# Altium schematic sheet MainBoard.SchDoc
size A; SheetNumber: 1; SheetTotal: 1
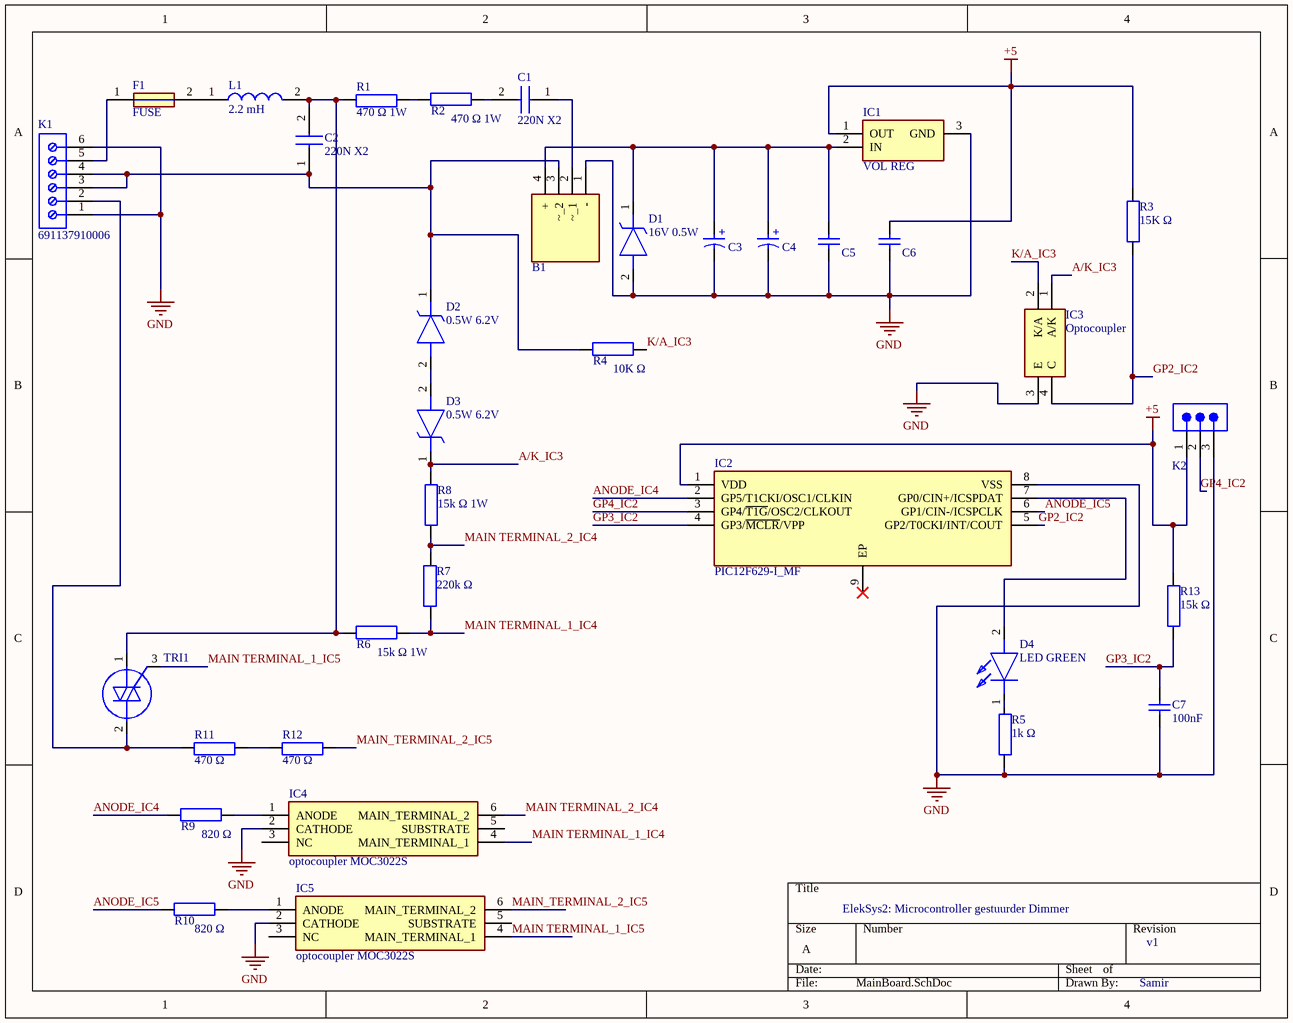
[diagram p0: MainBoard.SchDoc]

## Parts
B1  (no value)  [TO508P370X2000X1310-4P]
C1  220N X2  [B32932A_(18_x_8.5)]
C2  220N X2  [B32932A_(18_x_8.5)]
C3  220uF  [WCAP-ATG8_D8H11.5]  (value not drawn)
C4  220uF  [WCAP-ATG8_D8H11.5]  (value not drawn)
C5  100nF  [WCAP-CSGP_0805_L2W1.25H0.8_Reflow]  (value not drawn)
C6  100nF  [WCAP-CSGP_0805_L2W1.25H0.8_Reflow]  (value not drawn)
C7  100nF  [WCAP-CSGP_0805_L2W1.25H0.8_Reflow]
D1  16V 0.5W  [DIOM5226X220N]
D2  0.5W 6.2V  [Zener Diodes ZEN REG 0.5W 6.2V]
D3  0.5W 6.2V  [Zener Diodes ZEN REG 0.5W 6.2V]
D4  LED GREEN  [LED 0805]
F1  FUSE  [FUSE MRT]
IC1  VOL REG  [Vol reg]
IC2  PIC12F629-I_MF  [PIC12F629-I_MF]
IC3  Optocoupler  [optocoupler smd]
IC4  optocoupler MOC3022S  [optoucoupler MOC3022S]
IC5  optocoupler MOC3022S  [optoucoupler MOC3022S]
K1  691137910006  [691137910006]
K2  61300311121  [connector 3p M]  (value not drawn)
L1  2.2 mH  [2.2mH inductor]
R1  470 Ω 1W  [RES_THT_1W]
R2  470 Ω 1W  [RES_THT_1W]
R3  15K Ω  [Res 0805]
R4  10K Ω  [Res 0805]
R5  1k Ω  [Res 0805]
R6  15k Ω 1W  [RES_THT_1W]
R7  220k Ω  [Res 0805]
R8  15k Ω 1W  [RES_THT_1W]
R9  820 Ω  [Res 0805]
R10  820 Ω  [Res 0805]
R11  470 Ω  [Res 0805]
R12  470 Ω  [Res 0805]
R13  15k Ω  [Res 0805]
TRI1  BT137S-600,118  [triac bt137]  (value not drawn)

## Nets
+5: C6.2 IC1.1(OUT) IC2.1(VDD) K2.1 R3.1 R13.1
GND: B1.1(-) C3.2(N) C4.2(N) C5.1 C6.1 C7.2 D1.2(A) IC1.3(GND) IC2.8(VSS) IC3.3(E) IC4.2(CATHODE) IC5.2(CATHODE) K1.1 K1.6 K2.3 R5.2
A/K_IC3: D3.1(K) IC3.1(A/K) R8.1
ANODE_IC4: IC2.2(GP5/T1CKI/OSC1/CLKIN) R9.1
ANODE_IC5: IC2.6(GP1/CIN-/ICSPCLK) R10.1
GP2_IC2: IC2.5(GP2/T0CKI/INT/COUT) IC3.4(C) R3.2
GP3_IC2: C7.1 IC2.4(GP3/~{MCLR}/VPP) R13.2
GP4_IC2: IC2.3(GP4/~{T1G}/OSC2/CLKOUT) K2.2
K/A_IC3: IC3.2(K/A) R4.2
MAIN TERMINAL_1_IC4: IC4.4(MAIN_TERMINAL_1) R6.2 R7.1
MAIN TERMINAL_1_IC5: IC5.4(MAIN_TERMINAL_1) TRI1.3(G)
MAIN TERMINAL_2_IC4: IC4.6(MAIN_TERMINAL_2) R7.2 R8.2
MAIN_TERMINAL_2_IC5: IC5.6(MAIN_TERMINAL_2) R12.1
NetB1_2: B1.2(~_1) C1.1
NetB1_3: B1.3(~_2) C2.1 D2.1(K) K1.3 K1.4 R4.1
NetB1_4: B1.4(+) C3.1(P) C4.1(P) C5.2 D1.1(K) IC1.2(IN)
NetC1_2: C1.2 R2.2
NetC2_2: C2.2 L1.2 R1.2 R6.1 TRI1.1(MT1)
NetD2_2: D2.2(A) D3.2(A)
NetD4_1: D4.1(K) R5.1
NetD4_2: D4.2(A) IC2.7(GP0/CIN+/ICSPDAT)
NetF1_1: F1.1 K1.5
NetF1_2: F1.2 L1.1
NetIC4_1: IC4.1(ANODE) R9.2
NetIC5_1: IC5.1(ANODE) R10.2
NetK1_2: K1.2 R11.2 TRI1.2(MT2)
NetR1_1: R1.1 R2.1
NetR11_1: R11.1 R12.2

Not connected (* = marked no-connect by the designer): IC2 9(EP)*; IC4 3(NC) 5(SUBSTRATE); IC5 3(NC) 5(SUBSTRATE)

## Notes on the sheet
- ElekSys2: Microcontroller gestuurder Dimmer
- v1
- Samir
- (in symbol Elco D8-H11.5) +

## Library data of the parts
B1 = GBUA10M-BP: Bridge Rectifier GBUA10M-BP; Manufacturer_Name: MCC; Datasheet Link: https://www.mccsemi.com/pdf/Products/GBUA10M(JC).pdf; Height: 3.7mm; Manufacturer_Part_Number: GBUA10M-BP
C1 C2 = 220N X2 safetycap: Capacitor B32932A3224K189; Manufacturer_Name: TDK; Datasheet Link: https://product.tdk.com/system/files/dam/doc/product/capacitor/film/emi/data_sheet/20/20/ds/mkt_b32932_936.pdf; Manufacturer_Part_Number: B32932A3224K189; Mouser Part Number: 871-B32932A3224K189; Mouser Price/Stock: https://www.mouser.co.uk/ProductDetail/EPCOS-TDK/B32932A3224K189?qs=xUjyHVpcJwaD87vZwqy58g%3D%3D
C3 C4 = Elco D8-H11.5: WCAP-ATG8 Aluminum Electrolytic Capacitor, Radial, THT, D8 x H11.5mm, 220uF, 35V; Manufacturer Part Number: 860010574011; Manufacturer: Wurth Elektronik; Capacitance Tolerance: +/-20%; Dissipation Factor: 12%; Endurance: 2000h; Leakage Current: 77uA; Ripple Current: 385mA; Technical Reference: ATBE115221M035DSPA7B000; Category: Aluminum Electrolytic Capacitors; Match Code: WCAP-ATG8; ComponentLink1Description: Website Link; ComponentLink1URL: https://www.we-online.com/redexpert/article/860010574011?ad; ComponentLink2Description: Datasheet Link; ComponentLink2URL: https://www.we-online.com/redexpert/spec/860010574011?ad; Mount: Through Hole; Operating Temperature Max: 85°C; Operating Temperature Min: -40°C; Packaging: Ammo Pack; Height: 11.5mm; Diameter: 8mm; Capacitance: 220uF; Rated Voltage (DC): 35V
C5-C7 = CeramicCap 0805: WCAP-CSGP Multilayer Ceramic Chip Capacitor, General Purpose, size 0805, X7R, 100nF, 50VDC; Manufacturer Part Number: 885012207098; Manufacturer: Wurth Elektronik; Case/Size Code: 0805; Capacitance Tolerance: +/-10%; Dissipation Factor: 2.5%; Insulation Resistance: 5GOhm; Rated Voltage (DC): 50V; Technical Reference: X7R0805104K050DFCT10000; Category: Multilayer Ceramic Chip Capacitors; Match Code: WCAP-CSGP; ComponentLink1Description: Website Link; ComponentLink1URL: https://www.we-online.com/redexpert/article/885012207098?ad; ComponentLink2Description: Datasheet Link; ComponentLink2URL: https://www.we-online.com/redexpert/spec/885012207098?ad; Mount: Surface Mount; Operating Temperature Max: 125°C; Operating Temperature Min: -55°C; Packaging: Tape and Reel; Length: 2mm; Width: 1.25mm; Height: 0.8mm; Capacitance: 100nF; Ceramic Type: X7R
D1 = Zener 16V 0.5W: Zener Diode / SZ1SMA5930BT3G; Manufacturer_Name: onsemi; Datasheet Link: https://www.onsemi.com/pub/Collateral/1SMA5913BT3-D.PDF; Height: 2.2mm; Manufacturer_Part_Number: SZ1SMA5930BT3G; Mouser Part Number: 863-SZ1SMA5930BT3G; Mouser Price/Stock: https://www.mouser.co.uk/ProductDetail/onsemi/SZ1SMA5930BT3G?qs=PJJcWtbOkNU2Dey35wiGFw%3D%3D; Arrow Part Number: SZ1SMA5930BT3G; Arrow Price/Stock: https://www.arrow.com/en/products/sz1sma5930bt3g/on-semiconductor
D2 D3 = Zener Diodes ZEN REG 0.5W 6.2V: Zener Diode / SZMMSZ4691T1G; Manufacturer_Name: onsemi; Datasheet Link: https://componentsearchengine.com/Datasheets/2/SZMMSZ4691T1G.pdf; Height: 1.35mm; Manufacturer_Part_Number: SZMMSZ4691T1G; Mouser Part Number: 863-SZMMSZ4691T1G; Mouser Price/Stock: https://www.mouser.co.uk/ProductDetail/onsemi/SZMMSZ4691T1G?qs=PJJcWtbOkNVmtHltI2Mc2w%3D%3D; Arrow Part Number: SZMMSZ4691T1G; Arrow Price/Stock: https://www.arrow.com/en/products/szmmsz4691t1g/on-semiconductor?region=nac
D4 = LED GREEN: LED HSMG-C170; Manufacturer_Name: Avago Technologies; Datasheet Link: https://datasheet.datasheetarchive.com/originals/distributors/SFDatasheet-4/sf-00083853.pdf; Height: 0.8mm; Manufacturer_Part_Number: HSMG-C170; Mouser Part Number: 630-HSMG-C170; Mouser Price/Stock: https://www.mouser.co.uk/ProductDetail/Broadcom-Avago/HSMG-C170?qs=YDL0qNrpDT4lm8ArMPkMEA%3D%3D
F1 = FUSE MRT_1.6_AMMO: Manufacturer_Name: BelFuse; Manufacturer_Part_Number: MRT 1.6 AMMO; Datasheet Link: https://www.belfuse.com/resources/datasheets/circuitprotection/ds-cp-mrt-series.pdf; Height: 7.9mm; Mouser Part Number: 530-MRT1.6AMMO; Mouser Price/Stock: https://www.mouser.co.uk/ProductDetail/Bel-Fuse/MRT-16-AMMO?qs=MvPYbBWWJyvzAphvU3%252BjhQ%3D%3D; Arrow Part Number: MRT 1.6 AMMO; Arrow Price/Stock: https://www.arrow.com/en/products/mrt1.6-ammo/bel-group
IC1 = VOL REG: Integrated Circuit LM3480IM3X-5.0_NOPB; Manufacturer_Name: Texas Instruments; Manufacturer_Part_Number: LM3480IM3X-5.0/NOPB; Datasheet Link: http://www.ti.com/lit/gpn/LM3480; Height: 1.12mm; Mouser Part Number: 926-LM3480IM3X50NOPB; Mouser Price/Stock: https://www.mouser.co.uk/ProductDetail/Texas-Instruments/LM3480IM3X-5.0-NOPB?qs=X1J7HmVL2ZHSOja%2Fw1xDFA%3D%3D; Arrow Part Number: LM3480IM3X-5.0/NOPB; Arrow Price/Stock: https://www.arrow.com/en/products/lm3480im3x-5.0nopb/texas-instruments?region=nac
IC2 = PIC12F629-I_MF: Integrated Circuit; Manufacturer_Name: Microchip; Manufacturer_Part_Number: PIC12F629-I/MF; Datasheet Link: http://ww1.microchip.com/downloads/en/DeviceDoc/41190G.pdf; Height: 1mm; Mouser Part Number: 579-PIC12F629-I/MF; Mouser Price/Stock: https://www.mouser.co.uk/ProductDetail/Microchip-Technology-Atmel/PIC12F629-I-MF?qs=Ux5rHyN1IXRyFoXTct%252B9Fg%3D%3D; Arrow Part Number: PIC12F629-I/MF; Arrow Price/Stock: https://www.arrow.com/en/products/pic12f629-imf/microchip-technology
IC3 = optocoupler smd: Inductor SFH6206-3T; Manufacturer_Name: Vishay; Datasheet Link: https://www.vishay.com/docs/83675/sfh620a.pdf; Height: 4.1mm; Manufacturer_Part_Number: SFH6206-3T; Mouser Part Number: 782-SFH6206-3T; Mouser Price/Stock: https://www.mouser.co.uk/ProductDetail/Vishay-Semiconductors/SFH6206-3T?qs=%2Fjqivxn91cfcfJy%252Bpwis%2Fw%3D%3D; Arrow Part Number: SFH6206-3T; Arrow Price/Stock: https://www.arrow.com/en/products/sfh6206-3t/vishay?region=europe
IC4 IC5 = optocoupler MOC3022S: integrated circuit; Manufacturer_Name: Lite-On; Datasheet Link: http://optoelectronics.liteon.com/upload/download/DS-70-99-0019/MOC302X%20series%20201606.pdf; Height: 4.6mm; Manufacturer_Part_Number: MOC3022S; Mouser Part Number: 859-MOC3022S; Mouser Price/Stock: https://www.mouser.co.uk/ProductDetail/Lite-On/MOC3022S?qs=Xz6ZzMsXYiMGEjhojNzjUw%3D%3D; Arrow Part Number: MOC3022S; Arrow Price/Stock: https://www.arrow.com/en/products/moc3022s/lite-on-technology
K1 = connector: NexarPartId: 105950641
K2 = 3P connector: WR-PHD Pin Header, THT, Vertical, pitch 2.54mm, 1 Row, 3P 61300311121; Manufacturer: Wurth Elektronik; Contact Resistance: 20mOhm; Rated Current: 3A; Working Voltage: 250V; Withstanding Voltage: 500V; Manufacturer Part Number: 61300311121; Category: Board-to-Board Connectors; Match Code: WR-PHD; ComponentLink1Description: Website Link; ComponentLink1URL: https://www.we-online.com/redexpert/article/61300311121?ad; ComponentLink2Description: Datasheet Link; ComponentLink2URL: https://www.we-online.com/redexpert/spec/61300311121?ad; Mount: Through Hole; Operating Temperature Max: 105°C; Operating Temperature Min: -40°C; Packaging: Bag; Gender: Pin Header; Number of Pins: 3; Number of Rows: 1; Orientation: Vertical; Pitch: 2.54mm
L1 = 2mH2 inductor: Inductor  1140-222k-sc / 140-222K-RC; Manufacturer_Name: Bourns; Manufacturer_Part_Number: 1140-222K-RC; Datasheet Link: http://www.bourns.com/docs/Product-Datasheets/1140_series.pdf; Height: 26.162mm; Mouser Part Number: 542-1140-222K-RC; Mouser Price/Stock: https://www.mouser.co.uk/ProductDetail/Bourns/1140-222K-RC?qs=oBhrY4n2hVwJtcTK7vYUOQ%3D%3D; Arrow Part Number: 1140-222K-RC; Arrow Price/Stock: https://www.arrow.com/en/products/1140-222k-rc/bourns
R1 R2 R6 R8 = Resistor THT 1W: Manufacturer Part Number: 560050320001; Manufacturer: Wurth Elektronik; Match Code: WRIS-KSKE; Case/Size Code: 0805; Rated Current: 1.81A; Rated Power: 0.33W; Resistance: 0.1Ω; Resistance Tolerance: +/-1%; Technical Reference: KE0805R100F103LAATP0000; Temperature Coefficient of Resistance: 250ppm/°C; Category: Thick Film Resistors; ComponentLink1Description: Website Link; ComponentLink1URL: https://www.we-online.com/redexpert/article/560050320001?ad; ComponentLink2Description: Datasheet Link; ComponentLink2URL: https://www.we-online.com/redexpert/spec/560050320001?ad; Mount: Surface Mount; Operating Temperature Max: 155°C; Operating Temperature Min: -55°C; Packaging: Tape and Reel; Length: 2mm; Width: 1.25mm; Height: 0.6mm
R3-R5 R7 R9-R13 = Resistor 0805: WRIS-KSKE Thick Film Resistor, SMT, size 0805, 0.33W, 0.1Ω, +/-1%; Manufacturer Part Number: 560050320001; Manufacturer: Wurth Elektronik; Case/Size Code: 0805; Rated Current: 1.81A; Technical Reference: KE0805R100F103LAATP0000; Temperature Coefficient of Resistance: 250ppm/°C; Category: Thick Film Resistors; Match Code: WRIS-KSKE; ComponentLink1Description: Website Link; ComponentLink1URL: https://www.we-online.com/redexpert/article/560050320001?ad; ComponentLink2Description: Datasheet Link; ComponentLink2URL: https://www.we-online.com/redexpert/spec/560050320001?ad; Mount: Surface Mount; Operating Temperature Max: 155°C; Operating Temperature Min: -55°C; Packaging: Tape and Reel; Length: 2mm; Width: 1.25mm; Height: 0.6mm; Rated Power: 0.33W; Resistance: 0.1Ω; Resistance Tolerance: +/-1%
TRI1 = triac BT137S-600,118: Manufacturer_Name: WeEn Semiconductors; Datasheet Link: https://datasheet.datasheetarchive.com/originals/distributors/Datasheets_SAMA/6f648ac3c87a35283db8e9482e52c049.pdf; Height: 2.38mm; Manufacturer_Part_Number: BT137S-600,118; Mouser Part Number: 771-BT137S-600118; Mouser Price/Stock: https://www.mouser.co.uk/ProductDetail/WeEn-Semiconductors/BT137S-600118?qs=me8TqzrmIYXlu%252B8KdpBmXQ%3D%3D; Arrow Part Number: BT137S-600,118; Arrow Price/Stock: https://www.arrow.com/en/products/bt137s-600118/ween-semiconductors?region=nac